# Altium schematic sheet MainBoard_PWR.SchDoc
size 594 x 420 mm; DocumentNumber: VSL.23-MOTHERBOARD; SheetNumber: 7; Format: A2
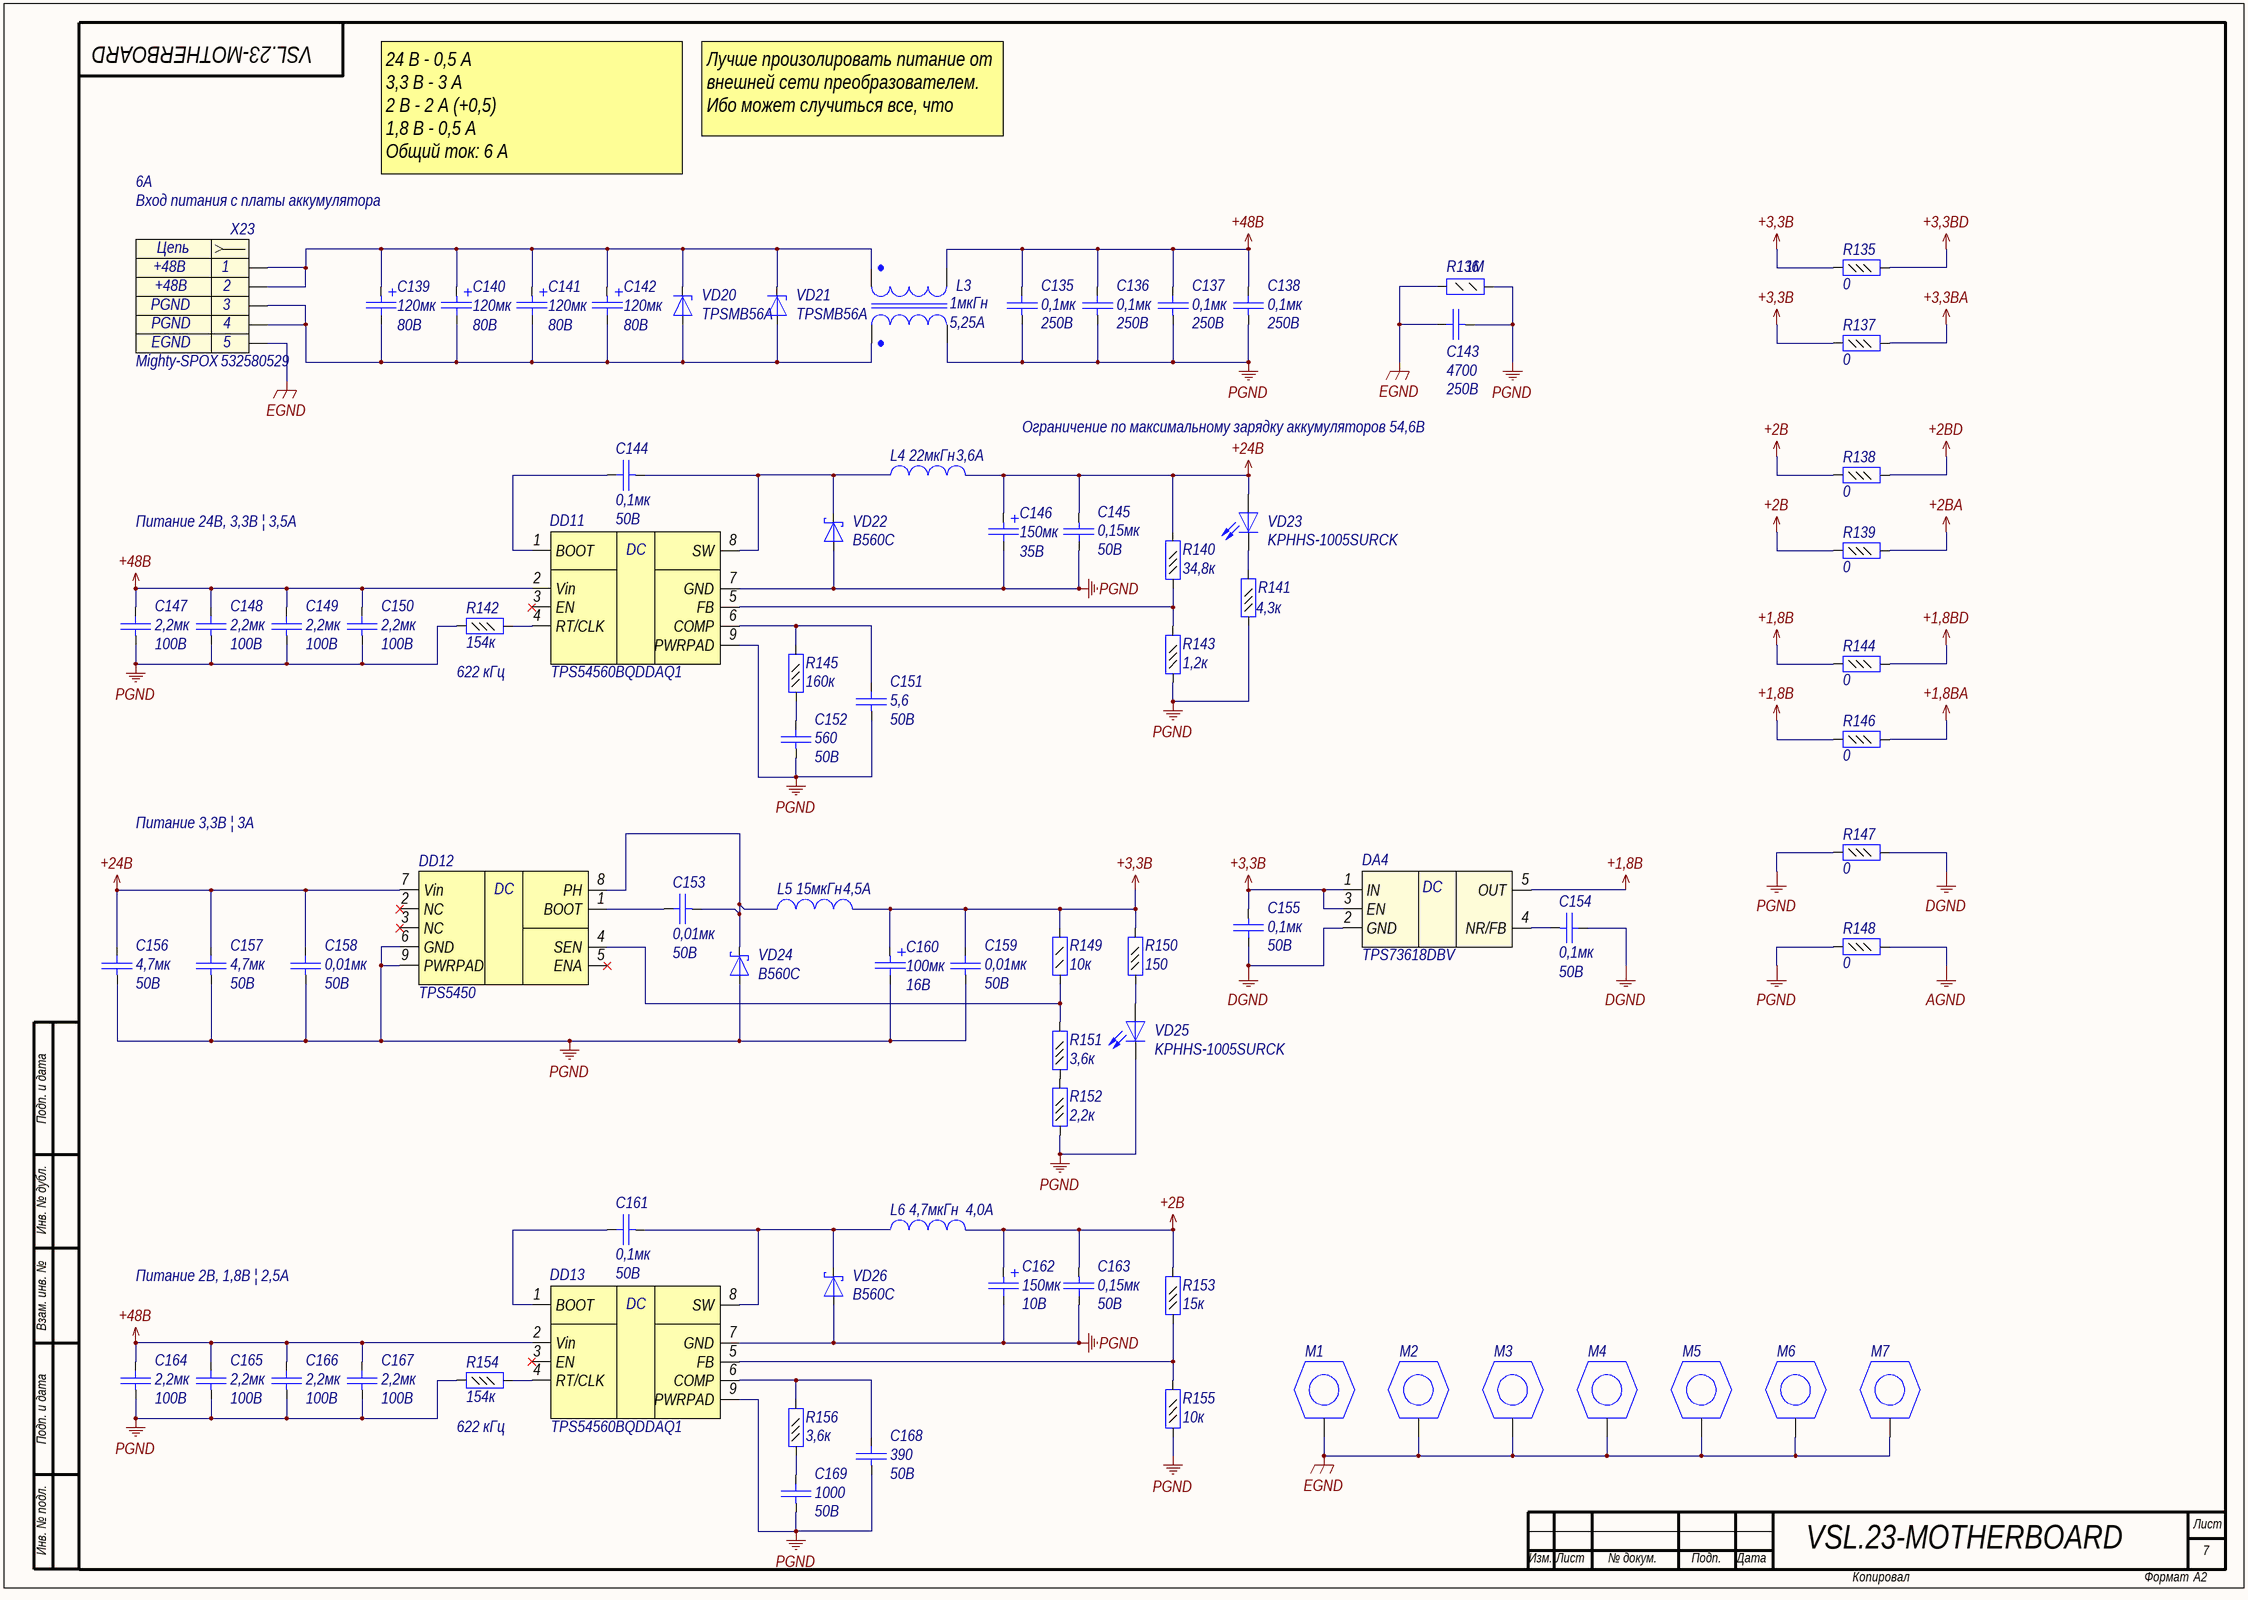
[diagram p0: MainBoard_PWR.SchDoc]

## Parts
C135  value 0,1мк  Voltage: 250В  [C1206]  (hidden comment: Capacitor)
C136  value 0,1мк  Voltage: 250В  [C1206]  (hidden comment: Capacitor)
C137  value 0,1мк  Voltage: 250В  [C1206]  (hidden comment: Capacitor)
C138  value 0,1мк  Voltage: 250В  [C1206]  (hidden comment: Capacitor)
C139  value 120мк  Voltage: 80В  [K50-35(8X20)_V]  (hidden comment: Capacitor_pol)
C140  value 120мк  Voltage: 80В  [K50-35(8X20)_V]  (hidden comment: Capacitor_pol)
C141  value 120мк  Voltage: 80В  [K50-35(8X20)_V]  (hidden comment: Capacitor_pol)
C142  value 120мк  Voltage: 80В  [K50-35(8X20)_V]  (hidden comment: Capacitor_pol)
C143  value 4700  Voltage: 250В  [C0805]  (hidden comment: Capacitor)
C144  Voltage: 50В  [C0402]  (hidden comment: 0,1мк)
C145  Voltage: 50В  [C1812]  (hidden comment: 0,15мк)
C146  value 150мк  Voltage: 35В  [Cap_SMD_radial_polar(8x10.2)]  (hidden comment: Capacitor_pol)
C147  Voltage: 100В  [C1812]  (hidden comment: 2,2мк)
C148  Voltage: 100В  [C1812]  (hidden comment: 2,2мк)
C149  Voltage: 100В  [C1812]  (hidden comment: 2,2мк)
C150  Voltage: 100В  [C1812]  (hidden comment: 2,2мк)
C151  Voltage: 50B  [C0402]  (hidden comment: 5,6)
C152  Voltage: 50B  [C0402]  (hidden comment: 560)
C153  Voltage: 50B  [C0402]  (hidden comment: 0,01мк)
C154  value 0,1мк  Voltage: 50В  [C0402]  (hidden comment: Capacitor)
C155  value 0,1мк  Voltage: 50В  [C0402]  (hidden comment: Capacitor)
C156  Voltage: 50В  [C0805]  (hidden comment: 4,7мк)
C157  Voltage: 50В  [C0805]  (hidden comment: 4,7мк)
C158  Voltage: 50B  [C0402]  (hidden comment: 0,01мк)
C159  Voltage: 50B  [C0402]  (hidden comment: 0,01мк)
C160  value 100мк  Voltage: 16В  [TANTAL CASE D]  (hidden comment: Capacitor_pol)
C161  Voltage: 50В  [C0402]  (hidden comment: 0,1мк)
C162  value 150мк  Voltage: 10B  [TANTAL CASE D]  (hidden comment: Capacitor_pol)
C163  Voltage: 50В  [C1812]  (hidden comment: 0,15мк)
C164  Voltage: 100В  [C1812]  (hidden comment: 2,2мк)
C165  Voltage: 100В  [C1812]  (hidden comment: 2,2мк)
C166  Voltage: 100В  [C1812]  (hidden comment: 2,2мк)
C167  Voltage: 100В  [C1812]  (hidden comment: 2,2мк)
C168  Voltage: 50B  [C0402]  (hidden comment: 390)
C169  Voltage: 50B  [C0402]  (hidden comment: 1000)
DA4  Part Number: TPS73618DBV  [SOT23-5]  (hidden comment: TPS736DBV)
DD11  Part Number: TPS54560BQDDAQ1  [SO Powerpad8]  (hidden comment: TPS54560)
DD12  TPS5450  [SO Powerpad8]
DD13  Part Number: TPS54560BQDDAQ1  [SO Powerpad8]  (hidden comment: TPS54560)
L3  value 1мкГн  Rated Current: 5,25A  [SRF0703]  (hidden comment: Dual-Winding Inductor)
L4  value 22мкГн  Rated Current: 3,6A  [IND_12.5x12.5]  (hidden comment: Inductor)
L5  value 15мкГн  Rated Current: 4,5A  [IND_12.5x12.5]  (hidden comment: Inductor)
L6  value 4,7мкГн  Rated Current: 4,0A  [SDR1006]  (hidden comment: Inductor)
M1  SCREW  [SCREW3]  (value not drawn)
M2  SCREW  [SCREW3]  (value not drawn)
M3  SCREW  [SCREW3]  (value not drawn)
M4  SCREW  [SCREW3]  (value not drawn)
M5  SCREW  [SCREW3]  (value not drawn)
M6  SCREW  [SCREW3]  (value not drawn)
M7  SCREW  [SCREW3]  (value not drawn)
R135  value 0  [R0402]  (hidden comment: Resistor_0,062Вт)
R136  value 1М  [R0805]  (hidden comment: Resistor_0,125Вт)
R137  value 0  [R0402]  (hidden comment: Resistor_0,062Вт)
R138  value 0  [R0402]  (hidden comment: Resistor_0,062Вт)
R139  value 0  [R0402]  (hidden comment: Resistor_0,062Вт)
R140  value 34,8к  [R0402]  (hidden comment: Resistor_0,062Вт)
R141  value 4,3к  [R0402]  (hidden comment: Resistor_0,062Вт)
R142  value 154к  [R0402]  (hidden comment: Resistor_0,062Вт)
R143  value 1,2к  [R0402]  (hidden comment: Resistor_0,062Вт)
R144  value 0  [R0402]  (hidden comment: Resistor_0,062Вт)
R145  value 160к  [R0402]  (hidden comment: Resistor_0,062Вт)
R146  value 0  [R0402]  (hidden comment: Resistor_0,062Вт)
R147  value 0  [R0402]  (hidden comment: Resistor_0,062Вт)
R148  value 0  [R0402]  (hidden comment: Resistor_0,062Вт)
R149  value 10к  [R0402]  (hidden comment: Resistor_0,125Вт)
R150  value 150  [R0402]  (hidden comment: Resistor_0,062Вт)
R151  value 3,6к  [R0402]  (hidden comment: Resistor_0,062Вт)
R152  value 2,2к  [R0402]  (hidden comment: Resistor_0,062Вт)
R153  value 15к  [R0402]  (hidden comment: Resistor_0,062Вт)
R154  value 154к  [R0402]  (hidden comment: Resistor_0,062Вт)
R155  value 10к  [R0402]  (hidden comment: Resistor_0,062Вт)
R156  value 3,6к  [R0402]  (hidden comment: Resistor_0,062Вт)
VD20  Part Number: TPSMB56A  [SMB]  (hidden comment: DiodeZener)
VD21  Part Number: TPSMB56A  [SMB]  (hidden comment: DiodeZener)
VD22  Part Number: B560C  [SMC]  (hidden comment: DiodeSchottky)
VD23  Part Number: KPHHS-1005SURCK  [L_0402_RED]  (hidden comment: LED)
VD24  Part Number: B560C  [SMC]  (hidden comment: DiodeSchottky)
VD25  Part Number: KPHHS-1005SURCK  [L_0402_RED]  (hidden comment: LED)
VD26  Part Number: B560C  [SMC]  (hidden comment: DiodeSchottky)
X23  Part Name: Mighty-SPOX  Part Number: 532580529  [MOLEX_532580529]  (hidden comment: Header_5_sct)

## Nets
+1,8B: DA4.5(OUT) R144.1 R146.1
+1,8BA: R146.2
+1,8BD: R144.2
+2B: C162.1 C163.1 L6.2 R138.1 R139.1 R153.2
+2BA: R139.2
+2BD: R138.2
+3,3B: C155.1 C159.2 C160.1 DA4.1(IN) DA4.3(EN) L5.2 R135.1 R137.1 R149.2 R150.2
+3,3BA: R137.2
+3,3BD: R135.2
+24B: C145.1 C146.1 C156.2 C157.2 C158.2 DD12.7(Vin) L4.2 R140.2 VD23.2(A)
+48B: C135.2 C136.2 C137.2 C138.2 C147.2 C148.2 C149.2 C150.2 C164.2 C165.2 C166.2 C167.2 DD11.2(Vin) DD13.2(Vin) L3.4
AGND: R148.2
DGND: C154.2 C155.2 DA4.2(GND) R147.2
EGND: C143.2 M1.1 M2.1 M3.1 M4.1 M5.1 M6.1 M7.1 R136.2 X23.5
PGND: C135.1 C136.1 C137.1 C138.1 C143.1 C145.2 C146.2 C147.1 C148.1 C149.1 C150.1 C151.1 C152.1 C156.1 C157.1 C158.1 C159.1 C160.2 C162.2 C163.2 C164.1 C165.1 C166.1 C167.1 C168.1 C169.1 DD11.7(GND) DD11.9(PWRPAD) DD12.6(GND) DD12.9(PWRPAD) DD13.7(GND) DD13.9(PWRPAD) L3.3 R136.1 R141.1 R142.1 R143.1 R147.1 R148.1 R152.1 R154.1 R155.1 VD22.2(A) VD24.2(A) VD25.1(K) VD26.2(A)
NetC139_1: C139.1 C140.1 C141.1 C142.1 L3.2 VD20.1(K) VD21.1(K) X23.1 X23.2
NetC139_2: C139.2 C140.2 C141.2 C142.2 L3.1 VD20.2(A) VD21.2(A) X23.3 X23.4
NetC144_1: C144.1 DD11.8(SW) L4.1 VD22.1(K)
NetC144_2: C144.2 DD11.1(BOOT)
NetC151_2: C151.2 DD11.6(COMP) R145.2
NetC152_2: C152.2 R145.1
NetC153_1: C153.1 DD12.8(PH) L5.1 VD24.1(K)
NetC153_2: C153.2 DD12.1(BOOT)
NetC154_1: C154.1 DA4.4(NR/FB)
NetC161_1: C161.1 DD13.8(SW) L6.1 VD26.1(K)
NetC161_2: C161.2 DD13.1(BOOT)
NetC168_2: C168.2 DD13.6(COMP) R156.2
NetC169_2: C169.2 R156.1
NetDD11_4: DD11.4(RT/CLK) R142.2
NetDD11_5: DD11.5(FB) R140.1 R143.2
NetDD12_4: DD12.4(SEN) R149.1 R151.2
NetDD13_4: DD13.4(RT/CLK) R154.2
NetDD13_5: DD13.5(FB) R153.1 R155.2
NetR141_2: R141.2 VD23.1(K)
NetR150_1: R150.1 VD25.2(A)
NetR151_1: R151.1 R152.2

Not connected (* = marked no-connect by the designer): DD11 3(EN)*; DD12 2(NC)* 3(NC)* 5(ENA)*; DD13 3(EN)*

## Notes on the sheet
- 24 B - 0,5 А
  3,3 B - 3 А
  2 В - 2 А (+0,5)
  1,8 В - 0,5 А
  Общий ток: 6 А
- Лучше произолировать питание от внешней сети преобразователем.
  Ибо может случиться все, что угодно.
- Вход питания с платы аккумулятора
- 6А
- Ограничение по максимальному зарядку аккумуляторов 54,6В
- Питание 24В, 3,3В | 3,5А
- 622 кГц
- Питание 3,3В | 3А
- Подп. и дата
- Инв. № дубл.
- Взам. инв. №
- Питание 2В, 1,8В | 2,5А
- Инв. № подл.
- Лист
- Изм.
- № докум.
- Подп.
- Дата
- Копировал
- Формат
- (in symbol connect106) Цепь
- (in symbol pwr12) DC
- (in symbol pwr118) DC
- (in symbol pwr127) DC

## Library data of the parts
C135-C138 = cap179: Конденсатор; Part Name: Ceramic; Manufacture: Murata; Part Number: GRM31CR72E104K; id: cap179; TKE: X7R
C139-C142 = cap300: Конденсатор полярный; Part Name: Electrolit; Manufacture: Panasonic; Part Number: EEU-FS1K121LB; id: cap300; tga: 0.08; Zmax: 0,096Ом; Ripple current: 0,81A
C143 = cap211: Конденсатор; Part Name: Ceramic; Manufacture: Murata; Part Number: GRM21AR72E472KW; id: cap211; TKE: X7R
C144 C154 C155 C161 = cap277: Конденсатор; Part Name: Ceramic; Manufacture: Murata; Part Number: GRM155R71H104KE14D; id: cap277; TKE: X7R; tga: 0,10%
  C144 C161: Value: 0,1мк
C145 C163 = cap285: Конденсатор; Part Name: Ceramic; Manufacture: TDK; Part Number: C4532C0G1H154J250KA; id: cap285; TKE: NP0; Value: 0,15мк
C146 = cap304: Конденсатор полярный; Part Name: Electrolit; Manufacture: Panasonic; Part Number: EEH-ZE1V151V; id: cap304; ESR: 27мОм
C147-C150 C164-C167 = cap293: Конденсатор; Part Name: MLCC; Manufacture: TDK; Part Number: C4532X7R2A225M; id: cap293; TKE: X7R; tga: 0,10%; Value: 2,2мк
C151 = cap4: Конденсатор; Part Name: Ceramic; Manufacture: Murata; Part Number: GRM1555C1H5R6C; id: cap4; TKE: NP0; Value: 5,6
C152 = cap25: Конденсатор; Part Name: Ceramic; Manufacture: Murata; Part Number: GRM1555C1H561J; id: cap25; TKE: NP0; Value: 560
C153 C158 C159 = cap42: Конденсатор; Part Name: Ceramic; Manufacture: Murata; Part Number: GRM155R71H103K; id: cap42; TKE: X7R; Value: 0,01мк
C156 C157 = cap224: Конденсатор; Part Name: Ceramic; Manufacture: Murata; Part Number: GRM21BZ71H475KE15L; id: cap224; TKE: X7R; Value: 4,7мк
C160 = cap210: Конденсатор полярный; Part Name: Tantal; Manufacture: Vishay; Part Number: 293D107X9016D2TE3; id: cap210
C162 = cap302: Конденсатор полярный; Part Name: Tantal; Part Number: TPSD157K010R0050; id: cap302; ESR: 50мОм
C168 = cap23: Конденсатор; Part Name: Ceramic; Manufacture: Murata; Part Number: GRM1555C1H391J; id: cap23; TKE: NP0; Value: 390
C169 = cap28: Конденсатор; Part Name: Ceramic; Manufacture: Murata; Part Number: GRM1555C1H102J; id: cap28; TKE: NP0; Value: 1000
DA4 = pwr118: 400-mA Low-Dropout Regulator with Reverse Current  Protection; Manufacturer: Texas Instruments; id: pwr118; Input Voltage: 1,7-5,5В; Output Voltage: 1,8B; Dropout Voltage: 75mB; Current: 400mA; Part Name: Low-Dropout Regulator with Reverse Current Protection; Type: Linear
DD11 DD13 = pwr127: 5-A, Wide Input Range, Step-Down Converter; Part Name: Step Down DC-DC Converter with Eco-mode; Manufacturer: Texas Instruments; id: pwr127; Input Voltage: 4,5-60В; Output Voltage: 0,8B-58,8B; Current: 5A; Frequency: 100 kHz-25 MHz; Type: Impulse
DD12 = pwr12: 5-A, Wide Input Range, Step-Down Converter; Manufacturer: Texas Instruments; id: pwr12; Input Voltage: 5,5 - 36B; Output Voltage: Adj; Current: 5A; Part Name: Step-Down Converter; Type: Impulse; Part Number: TPS5450
L3 = ind10: Синфазный дроссель; Part Name: Dual-Winding Shielded Power Inductors; Part Number: SRF0703-1R0M; Manufacture: Bourns; id: ind10; Saturation Current: 7,97A; Resistance: 0,0135Ohm
L4 = ind79: EMI Suppression Filter; Part Name: SMD Power Inductors; Part Number: B82477G4223M000; Manufacture: Epcos; id: ind79; Saturation Current: 4,25A; Resistance: 0,038Ohm
L5 = ind78: EMI Suppression Filter; Part Name: SMD Power Inductors; Part Number: B82477G4153M000; Manufacture: Epcos; id: ind78; Saturation Current: 5,25A; Resistance: 0,027Ohm
L6 = ind95: EMI Suppression Filter; Part Name: SMD Power Inductors; Part Number: SDR1006-4R7ML; Manufacture: Bourns; id: ind95; Saturation Current: 7,3A; Resistance: 0,036Ohm
M1-M7 = connect89: Part Name: Винт М3 с заземлением; id: connect89
R135 R137-R139 R144 R146-R148 = res390: Резистор; Manufacture: Yageo; Part Number: RC0603FR-070RL; id: res390; Accuracy: 0,01; Part Name: Resistor; Power: 0,062Вт
R136 = res149: Резистор; Manufacture: Yageo; Part Number: RC0805FR-071ML; id: res149; Accuracy: 0,01; Part Name: Resistor; Power: 0,125Вт
R140 = res1193: Резистор; Manufacture: Yageo; Part Number: RC0402FR-0734K8L; Accuracy: 0,01; id: res1193; Part Name: Resistor; Power: 0,062Вт
R141 = res285: Резистор; Manufacture: Yageo; Part Number: RC0402FR-074K3; id: res285; Accuracy: 0,01; Part Name: Resistor; Power: 0,062Вт
R142 R154 = res1211: Резистор; Manufacture: Yageo; Part Number: RC0402FR-07154KL; Accuracy: 0,01; id: res1211; Part Name: Resistor; Power: 0,062Вт
R143 = res272: Резистор; Manufacture: Yageo; Part Number: RC0402FR-071K2; id: res272; Accuracy: 0,01; Part Name: Resistor; Power: 0,062Вт
R145 = res323: Резистор; Manufacture: Yageo; Part Number: RC0402FR-07160KL; id: res323; Accuracy: 0,01; Part Name: Resistor; Power: 0,062Вт
R149 = res97: Резистор; Manufacture: Yageo; Part Number: RC0805FR-0710KL; id: res97; Accuracy: 0,01; Part Name: Resistor; Power: 0,125Вт
R150 = res250: Резистор; Manufacture: Yageo; Part Number: RC0402FR-07150RL; id: res250; Accuracy: 0,01; Part Name: Resistor; Power: 0,062Вт
R151 R156 = res283: Резистор; Manufacture: Yageo; Part Number: RC0402FR-072K6; id: res283; Accuracy: 0,01; Part Name: Resistor; Power: 0,062Вт
R152 = res278: Резистор; Manufacture: Yageo; Part Number: RC0402FR-072K2; id: res278; Accuracy: 0,01; Part Name: Resistor; Power: 0,062Вт
R153 = res491: Резистор; Manufacture: Yageo; Part Number: RC0603FR-0715KL; id: res491; Accuracy: 0,01; Part Name: Resistor; Power: 0,062Вт
R155 = res487: Резистор; Manufacture: Yageo; Part Number: RC0603FR-0710KL; id: res487; Accuracy: 0,01; Part Name: Resistor; Power: 0,062Вт
VD20 VD21 = TPSMB56A: Cтабилитрон (лавинный выпрямительный диод) односторонний; Part Name: TVS diode Unidirectional; Manufacture: Littelfuse; id: tvs285; Leakage Current: 8uA; Stand-off Voltage: 56B; Breakdown Voltage: 58,8B; Clamping voltage: 77B; Peak Pulse Power: 600W; Number of diodes: 1
VD22 VD24 VD26 = diode32: Диод Шоттки; Part Name: SCHOTTKY BARRIER RECTIFIER; Manufacture: Diodes Incorporated; Max Reverse Voltage: 60B; Forward Voltage: 0,7B; Forward Current: 5A; Leakage current: 20mA; Capacitance: 300pF; Number of Channels: 1; id: diode32; Breakdown Voltage: 60B; Temp MAX: +150; Temp MIN: -55
VD23 VD25 = diode28: Светодиод; Part Name: LED red; id: diode28
X23 = connect106: Разъем - 5 конт. розетка; Manufacture: Molex; Contact_1: +48B; Contact_3: PGND; Contact_5: EGND; Etch: 3.5mm; Contact_2: +48B; Contact_4: PGND; id: connect106